# EAGLE design LickDetector 8mm (EAGLE 9.4.0)
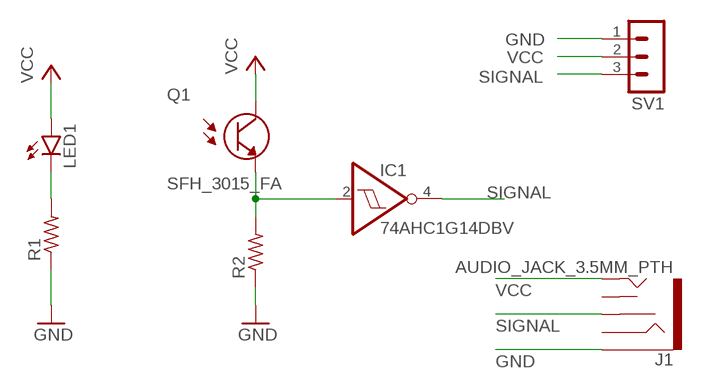
[diagram p0: schematic, sheet 1]

## Parts
IC1  74AHC1G14DBV  [SOT23-5]
J1  AUDIO_JACK_3.5MM_PTH  [AUDIO-JACK]
LED1  LEDCHIPLED_1206  [CHIPLED_1206]
Q1  SFH_3015_FA  [XDCR_SFH_3015_FA]
R1  R-US_M1206  [M1206]
R2  R-US_M1206  [M1206]
SV1  MA03-1  [MA03-1]

## Nets
GND: J1.SLEEVE R1.1 R2.1 SV1.1
N$1: LED1.C R1.2
N$2: IC1.2(I) Q1.1(E) R2.2
SIGNAL: IC1.4(O) J1.RSH SV1.3
VCC: J1.TIP LED1.A Q1.2(C) SV1.2
Unconnected: J1.RING J1.TSH

## Power pins joined to a net without a drawn wire
GND: IC1.3(GND)
VCC: IC1.5(VCC)

## Library data of the parts
IC1 = 74xx-little-de:74*1G14: Single Schmitt-Trigger Inverter Gate
J1 = SparkFun-Connectors:AUDIO_JACK_3.5MM: Audio Jack 3.5mm variants of PTH and SMT stereo audio jack with bypass switches. SparkFun Products: SparkFun SparkPunk Sound Kit <[https://www.sparkfun.com/products/11177]> - PTH MP3 Trigger <https://www.sparkfun.com/products/13720> -3.5mm SMD SparkFun PicoBoard <https://www.sparkfun.com/products/11888>- 2.5mm SMD; PROD_ID: CONN-08774; SF_ID: PRT-08032
LED1 = led:LED: LED OSRAM: - CHIPLED LG R971, LG N971, LY N971, LG Q971, LY Q971, LO R971, LY R971 LH N974, LH R974 LS Q976, LO Q976, LY Q976 LO Q996 - Hyper CHIPLED LW Q18S LB Q993, LB Q99A, LB R99A - SideLED LS A670, LO A670, LY A670, LG A670, LP A670 LB A673, LV A673, LT A673, LW A673 LH A674 LY A675 LS A676, LA A676, LO A676, LY A676, LW A676 LS A679, LY A679, LG A679 - Hyper Micro SIDELED® LS Y876, LA Y876, LO Y876, LY Y876 LT Y87S - SmartLED LW L88C, LW L88S LB L89C, LB L89S, LG L890 LS L89K, LO L89K, LY L89K LS L896, LA L896, LO L896, LY L896 - TOPLED LS T670, LO T670, LY T670, LG T670, LP T670 LSG T670, LSP T670, LSY T670, LOP T670, LYG T670 LG T671, LOG T671, LSG T671 LB T673, LV T673, LT T673, LW T673 LH T674 LS T676, LA T676, LO T676, LY T676, LB T676, LH T676, LSB T676, LW T676 LB T67C, LV T67C, LT T67C, LS T67K, LO T67K, LY T67K, LW E67C LS E67B, LA E67B, LO E67B, LY E67B, LB E67C, LV E67C, LT E67C LW T67C LS T679, LY T679, LG T679 LS T770, LO T770, LY T770, LG T770, LP T770 LB T773, LV T773, LT T773, LW T773 LH T774 LS E675, LA E675, LY E675, LS T675 LS T776, LA T776, LO T776, LY T776, LB T776 LHGB T686 LT T68C, LB T68C - Hyper Mini TOPLED® LB M676 - Mini TOPLED Santana® LG M470 LS M47K, LO M47K, LY M47K Source: http://www.osram.convergy.de LUXEON: - LUMILED® LXK2-PW12-R00, LXK2-PW12-S00, LXK2-PW14-U00, LXK2-PW14-V00 LXK2-PM12-R00, LXK2-PM12-S00, LXK2-PM14-U00 LXK2-PE12-Q00, LXK2-PE12-R00, LXK2-PE12-S00, LXK2-PE14-T00, LXK2-PE14-U00 LXK2-PB12-K00, LXK2-PB12-L00, LXK2-PB12-M00, LXK2-PB14-N00, LXK2-PB14-P00, LXK2-PB14-Q00 LXK2-PR12-L00, LXK2-PR12-M00, LXK2-PR14-Q00, LXK2-PR14-R00 LXK2-PD12-Q00, LXK2-PD12-R00, LXK2-PD12-S00 LXK2-PH12-R00, LXK2-PH12-S00 LXK2-PL12-P00, LXK2-PL12-Q00, LXK2-PL12-R00 Source: www.luxeon.com KINGBRIGHT: KA-3528ASYC Source: www.kingbright.com
Q1 = SFH_3015_FA:SFH_3015_FA: Phototransistor Chip NPN Transistor 870nm 2-Pin SMD T/R; DESCRIPTION: Phototransistor Chip NPN Transistor 870nm 2-Pin SMD T/R; DIGI-KEY_PART_NUMBER: 475-2914-1-ND; DIGI-KEY_PURCHASE_URL: https://www.digikey.com/product-detail/en/osram-opto-semiconductors-inc/SFH-3015-FA/475-2914-1-ND/2415041?utm_source=snapeda&utm_medium=aggregator&utm_campaign=symbol; MF: OSRAM Opto; MP: SFH 3015 FA; PACKAGE: 1206 Osram Opto
R1 R2 = resistor:R-US_: RESISTOR, American symbol
SV1 = con-lstb:MA03-1: PIN HEADER; OC_FARNELL: unknown; OC_NEWARK: unknown

## Board
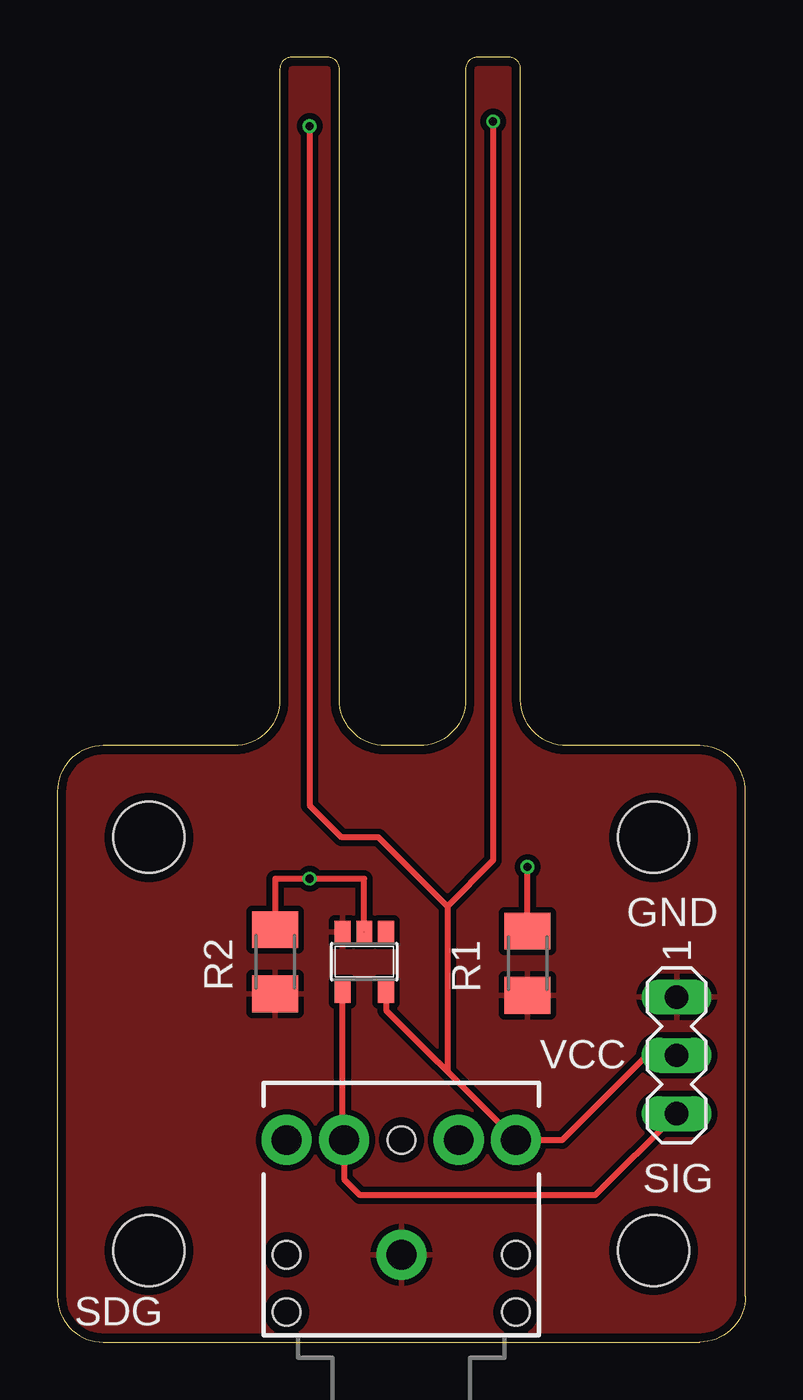
[diagram p1: board, top side]
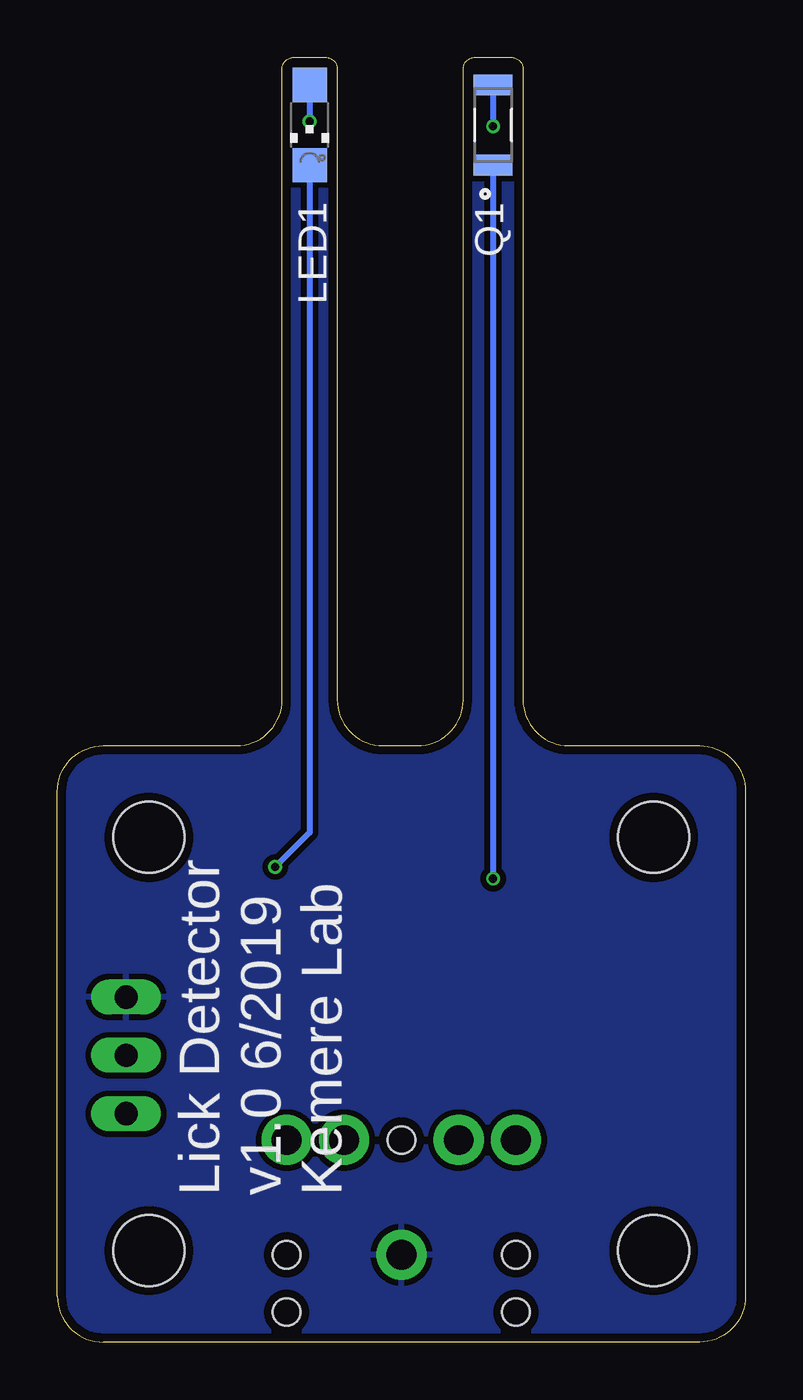
[diagram p2: board, bottom side, seen from below]

Size 30 x 56 mm. Coordinates in mm from the lower left corner, seen from the top.
Outline: 30,2 30,24 arc90 28,26 22.2,26 arc-90 20.2,28 20.2,55.5 arc90 19.7,56 18.3,56 arc90 17.8,55.5 17.8,28 arc-90 15.8,26 14.3,26 arc-90 12.3,28 12.3,55.5 arc90 11.8,56 10.2,56 arc90 9.7,55.5 9.7,28 arc-90 7.7,26 2,26 arc90 0,24 0,2 arc90 2,0 28,0 arc90 30,2
Copper layers (1*16): Top 0.035559375mm / dielectric 1.6mm / Bottom 0.035559375mm
Design rules "oshpark-2layer": minimum track width 6mil, minimum drill 10mil, track to track 6mil, track to pad 6mil, pad to pad 6mil, via to via 6mil, smd to smd 6mil, copper to edge 15mil, drill to drill 6mil, minimum pad ring 5mil, minimum via ring 5mil, stop-mask expansion 2.5mil, vias tented up to drill 0mil, thermal gap 10mil
Holes 3.1 mm at 4,22 26,22 4,4 26,4

### Footprints (pad centres in the part's own frame; a part is rotated, then mirrored left to right if it is on the bottom)
SOT23-5 = smd 0.69 x 0.99: 1 -0.95,-1.29; 2 0,-1.29; 3 0.95,-1.29; 4 0.95,1.3; 5 -0.95,1.3
AUDIO-JACK = drill 1.3 pad 2.184: RING 5,5; RSH 5,2.5; SLEEVE 0,0; TIP 5,-5; TSH 5,-2.5 | hole 1.2: 0,5; -2.5,5; -2.5,-5; 0,-5; 5,0
CHIPLED_1206 = smd 1.5 x 1.5: A 0,-1.75; C 0,1.75
XDCR_SFH_3015_FA = smd 0.9 x 1.7: 1 -1.75,0; 2 1.75,0
M1206 = smd 1.6 x 2: 1 -1.4,0; 2 1.4,0
MA03-1 = drill 1.016 long: 1 -2.54,0; 2 0,0; 3 2.54,0

### Placement (x,y rotation side)
IC1  13.38,16.58 180 top
J1  15,3.81 90 top
LED1  19,53.05 180 bottom
Q1  11,53.05 90 bottom
R1  20.5,16.51 90 top
R2  9.5,16.58 90 top
SV1  27,12.5 270 top

### Tracks (layer width: path | path; a pad name or v marks a point on that pad's centre or on a via)
GND
  pour Top (isolate 0.25): 30,0 30,55.8 0,55.8 0,0
  pour Bottom (isolate 0.25): 0,0 30,0 30,55.8 0,55.8 0,0
N$1  (via drill 0.35)
  Top 0.254: R1.2 v20.5,20.71
  Bottom 0.254: LED1.C 19,22.21 v20.5,20.71
N$2  (via drill 0.35)
  Top 0.254: R2.2 9.5,20.2 v11,20.2 13.38,20.2 IC1.2
  Bottom 0.254: Q1.1 v11,20.2
SIGNAL
  Top 0.254: IC1.4 12.43,8.88 J1.RSH 12.5,7.1 13.2,6.4 23.44,6.4 SV1.3
VCC  (via drill 0.35)
  Top 0.254: IC1.5 14.33,14.47 16.6,12.2 16.61,12.2 17,11.81 | 17,11.81 J1.TIP 21.99,8.81 22,8.8 25.7,12.5 SV1.2 | 17,19 14,22 12.4,22 11,23.4 v11,53.01 | 17,19 17,11.81 | 17,19 19,21 v19,53.21
  Bottom 0.254: Q1.2 v11,53.01 | LED1.A v19,53.21

### Text on the board
tNames: GND | VCC | SIG | SDG
bNames: Lick Detector / v1.0 6/2019 / Kemere Lab